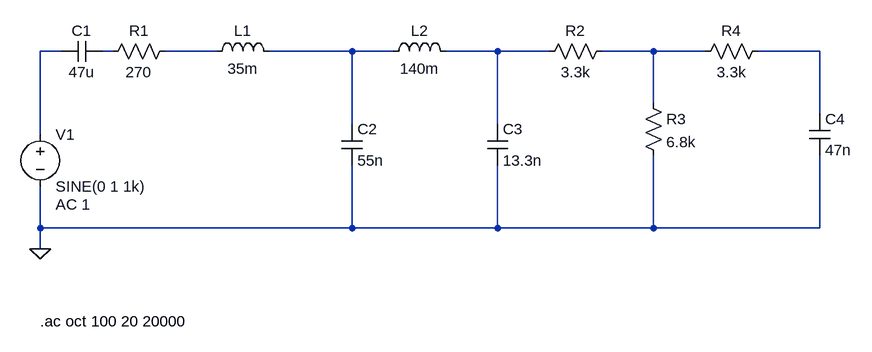
[diagram p0: schematic Palmer PDI-09.asc]
Palmer PDI-09.asc, the LTspice schematic file:
Version 4
SHEET 1 1128 680
WIRE -96 0 -128 0
WIRE -16 0 -32 0
WIRE 144 0 64 0
WIRE 352 0 224 0
WIRE 416 0 352 0
WIRE 576 0 496 0
WIRE 656 0 576 0
WIRE 816 0 736 0
WIRE 896 0 816 0
WIRE 1072 0 976 0
WIRE 816 80 816 0
WIRE 1072 96 1072 0
WIRE 352 112 352 0
WIRE 576 112 576 0
WIRE -128 128 -128 0
WIRE -128 272 -128 208
WIRE 352 272 352 176
WIRE 352 272 -128 272
WIRE 576 272 576 176
WIRE 576 272 352 272
WIRE 816 272 816 160
WIRE 816 272 576 272
WIRE 1072 272 1072 160
WIRE 1072 272 816 272
WIRE -128 304 -128 272
FLAG -128 304 0
SYMBOL voltage -128 112 R0
WINDOW 123 24 124 Left 2
WINDOW 39 0 0 Left 2
SYMATTR InstName V1
SYMATTR Value SINE(0 1 1k)
SYMATTR Value2 AC 1
SYMBOL cap -32 -16 R90
WINDOW 0 0 32 VBottom 2
WINDOW 3 32 32 VTop 2
SYMATTR InstName C1
SYMATTR Value 47u
SYMBOL cap 336 112 R0
SYMATTR InstName C2
SYMATTR Value 55n
SYMBOL cap 560 112 R0
SYMATTR InstName C3
SYMATTR Value 13.3n
SYMBOL res 80 -16 R90
WINDOW 0 0 56 VBottom 2
WINDOW 3 32 56 VTop 2
SYMATTR InstName R1
SYMATTR Value 270
SYMBOL ind 128 16 R270
WINDOW 0 32 56 VTop 2
WINDOW 3 5 56 VBottom 2
SYMATTR InstName L1
SYMATTR Value 35m
SYMBOL ind 400 16 R270
WINDOW 0 32 56 VTop 2
WINDOW 3 5 56 VBottom 2
SYMATTR InstName L2
SYMATTR Value 140m
SYMBOL res 752 -16 R90
WINDOW 0 0 56 VBottom 2
WINDOW 3 32 56 VTop 2
SYMATTR InstName R2
SYMATTR Value 3.3k
SYMBOL res 800 64 R0
SYMATTR InstName R3
SYMATTR Value 6.8k
SYMBOL cap 1056 96 R0
SYMATTR InstName C4
SYMATTR Value 47n
SYMBOL res 992 -16 R90
WINDOW 0 0 56 VBottom 2
WINDOW 3 32 56 VTop 2
SYMATTR InstName R4
SYMATTR Value 3.3k
TEXT -128 416 Left 2 !.ac oct 100 20 20000

The netlist it stands for:
* Palmer PDI-09.asc
V1 N001 0 SINE(0 1 1k) AC 1
C1 N002 N001 47u
C2 N004 0 55n
C3 N005 0 13.3n
R1 N003 N002 270
L1 N003 N004 35m
L2 N004 N005 140m
R2 N006 N005 3.3k
R3 N006 0 6.8k
C4 N007 0 47n
R4 N007 N006 3.3k
.ac oct 100 20 20000
.backanno
.end